# EAGLE design buttonboard (EAGLE 8.2.2)
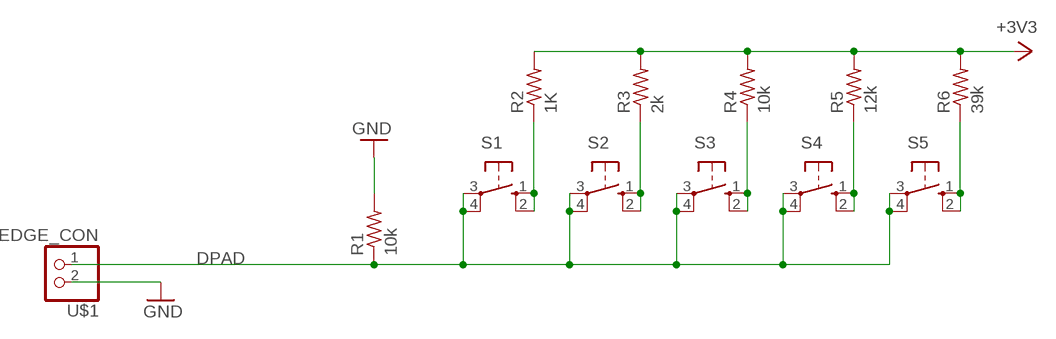
[diagram p0: schematic, sheet 1]

## Parts
R1  10k  R-US_R0805  [R0805]
R2  1K  R-US_R0805  [R0805]
R3  2k  R-US_R0805  [R0805]
R4  10k  R-US_R0805  [R0805]
R5  12k  R-US_R0805  [R0805]
R6  39k  R-US_R0805  [R0805]
S1  10-XX  [B3F-10XX]
S2  10-XX  [B3F-10XX]
S3  10-XX  [B3F-10XX]
S4  10-XX  [B3F-10XX]
S5  10-XX  [B3F-10XX]
U$1  EDGE_CON  [EDGE_CON_2]

## Nets
+3V3: R2.2 R3.2 R4.2 R5.2 R6.2
DPAD: R1.1 S1.3(P) S1.4(P1) S2.3(P) S2.4(P1) S3.3(P) S3.4(P1) S4.3(P) S4.4(P1) S5.3(P) S5.4(P1) U$1.1
GND: R1.2
N$27: R2.1 S1.1(S) S1.2(S1)
N$29: R3.1 S2.1(S) S2.2(S1)
N$31: R4.1 S3.1(S) S3.2(S1)
N$33: R5.1 S4.1(S) S4.2(S1)
N$35: R6.1 S5.1(S) S5.2(S1)
Unconnected: U$1.2

## Library data of the parts
R1-R6 = resistor:R-US_: RESISTOR, American symbol
S1-S5 = switch-omron:10-XX: OMRON SWITCH; MPN: B3F-1000; OC_FARNELL: 176432; OC_NEWARK: 36M3542
U$1 = WISE:EDGE_CON

## Board
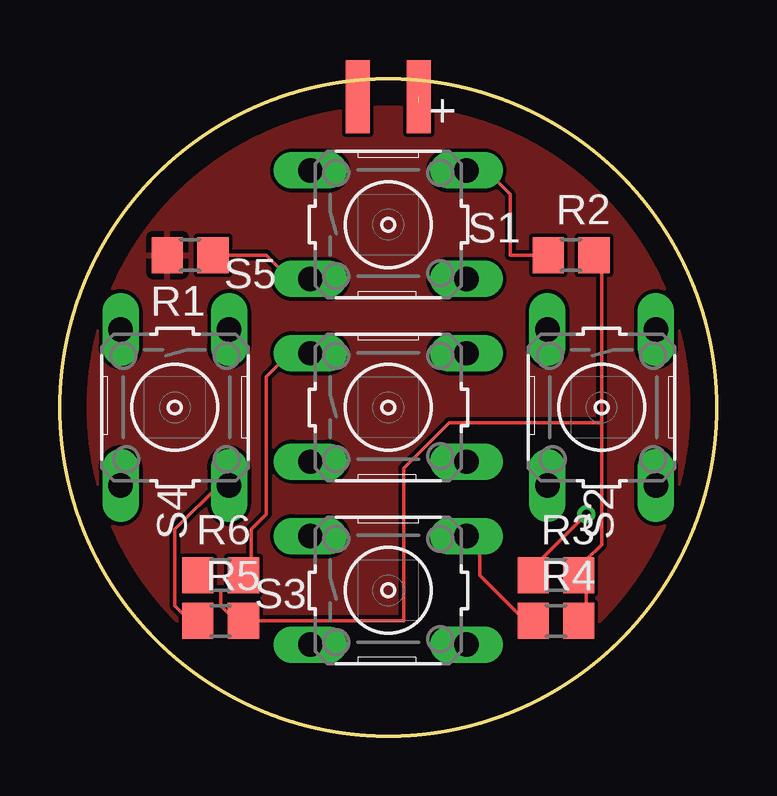
[diagram p1: board, top side]
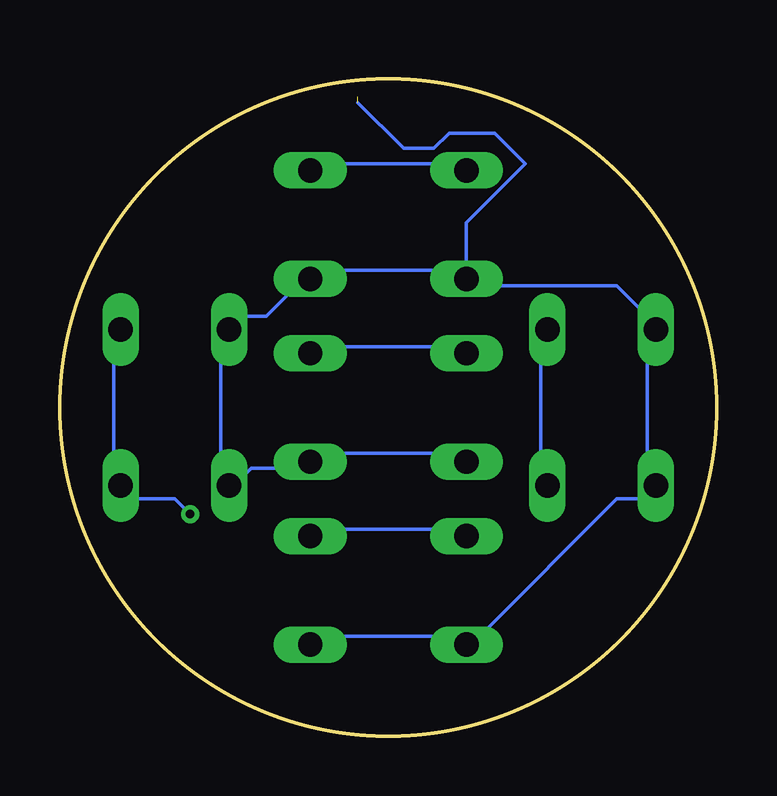
[diagram p2: board, bottom side, seen from below]

Size 27.36 x 27.36 mm. Coordinates in mm from the lower left corner, seen from the top.
Outline: circle at 13.68,13.68 radius 13.68
Copper layers (1*16): Top 0.035mm / dielectric 1.5mm / Bottom 0.035mm
Design rules "default": minimum track width 6mil, minimum drill 0.35mm, track to track 6mil, track to pad 6mil, pad to pad 6mil, via to via 6mil, smd to smd 6mil, copper to edge 40mil, drill to drill 6mil, minimum pad ring 10mil, minimum via ring 8mil, stop-mask expansion 4mil, vias tented up to drill 0mil, thermal gap 10mil

### Footprints (pad centres in the part's own frame; a part is rotated, then mirrored left to right if it is on the bottom)
R0805 = smd 1.3 x 1.5: 1 -0.95,0; 2 0.95,0
B3F-10XX = drill 1.016 long: 1 -3.251,2.261; 2 3.251,2.261; 3 -3.251,-2.261; 4 3.251,-2.261
EDGE_CON_2 = smd 1.016 x 3.048: 1 1.27,1.524; 2 -1.27,1.524

### Placement (x,y rotation side)
R1  5.42,20.03 180 top
R2  21.3,20.03 0 top
R3  20.66,6.69 0 top
R4  20.66,4.79 0 top
R5  6.69,4.79 0 top
R6  33k  [R0805]  6.69,6.69 180 top
S1  13.68,21.3 0 top
S2  22.57,13.68 270 top
S3  13.68,6.06 0 top
S4  4.79,13.68 270 top
S5  13.68,13.68 0 top
U$1  13.68,25.11 0 top

### Tracks (layer width: path | path; a pad name or v marks a point on that pad's centre or on a via)
+3V3
  Top 0.152: R6.2 6.06,6.69 6.06,6.06 6.69,6.06 6.69,5.42 7.33,4.79 R5.2 14.31,4.79 14.31,11.14 16.22,13.04 22.57,13.04 | 21.93,6.69 21.93,4.79 R4.2 | 22.57,13.04 22.57,7.96 21.93,7.33 21.93,6.69 | 22.57,13.04 22.57,20.03 R2.2 | 21.93,6.69 R3.2
DPAD  (1 unrouted)
  Top 0.152: R1.1 8.6,20.03 9.87,18.76 S1.3
  Bottom 0.152: S5.3 10.5,11.77 16.85,11.77 S5.4 17.49,11.14 19.39,11.14 20.03,10.5 S2.4 20.66,10.5 20.66,16.85 S2.3 20.03,17.49 18.76,17.49 17.49,18.76 S1.4 16.85,19.39 10.5,19.39 S1.3 | S3.4 16.85,4.15 10.5,4.15 S3.3 9.87,4.15 4.15,9.87 2.88,9.87 S4.4 2.88,10.5 2.88,16.85 S4.3 2.88,17.49 4.15,18.76 9.87,18.76 S1.3 | S1.3 10.43,21.37 7.96,23.84 9.23,25.11 11.14,25.11 11.77,24.47 13.04,24.47 14.95,26.38
GND
  pour Top: -0.29,27.65 27.65,27.65 27.65,-0.93 -0.29,-0.93
N$27
  Top 0.152: R2.1 18.76,20.03 18.76,22.57 17.49,23.84 S1.2
  Bottom 0.152: S1.1 10.5,23.84 16.85,23.84 S1.2
N$29  (via drill 0.35)
  Top 0.152: v21.93,9.23 20.03,7.33 20.03,6.69 R3.1
  Bottom 0.152: v21.93,9.23 22.57,9.87 24.47,9.87 S2.2 25.11,10.5 25.11,16.85 S2.1
N$31
  Top 0.152: R4.1 19.39,4.79 17.49,6.69 17.49,7.96 S3.2
  Bottom 0.152: S3.1 10.5,8.6 16.85,8.6 S3.2
N$33
  Top 0.152: R5.1 5.42,4.79 4.79,5.42 4.79,8.6 6.69,10.5 S4.2
  Bottom 0.152: S4.1 7.33,16.85 7.33,10.5 S4.2
N$35
  Top 0.152: R6.1 7.96,6.69 7.96,8.6 8.6,9.23 8.6,14.95 9.87,16.22 S5.1
  Bottom 0.152: S5.2 16.85,16.22 10.5,16.22 S5.1